# Altium schematic sheet 07_GSM_EM05.SchDoc: =TitleParameter
size A3; Address: Crete IL; Organization: ASISGUARD; Address1: Kemalpasa, Kemalpasa Cd. No:290 D:292H, 35060 Bornova/Izmir/Turkey
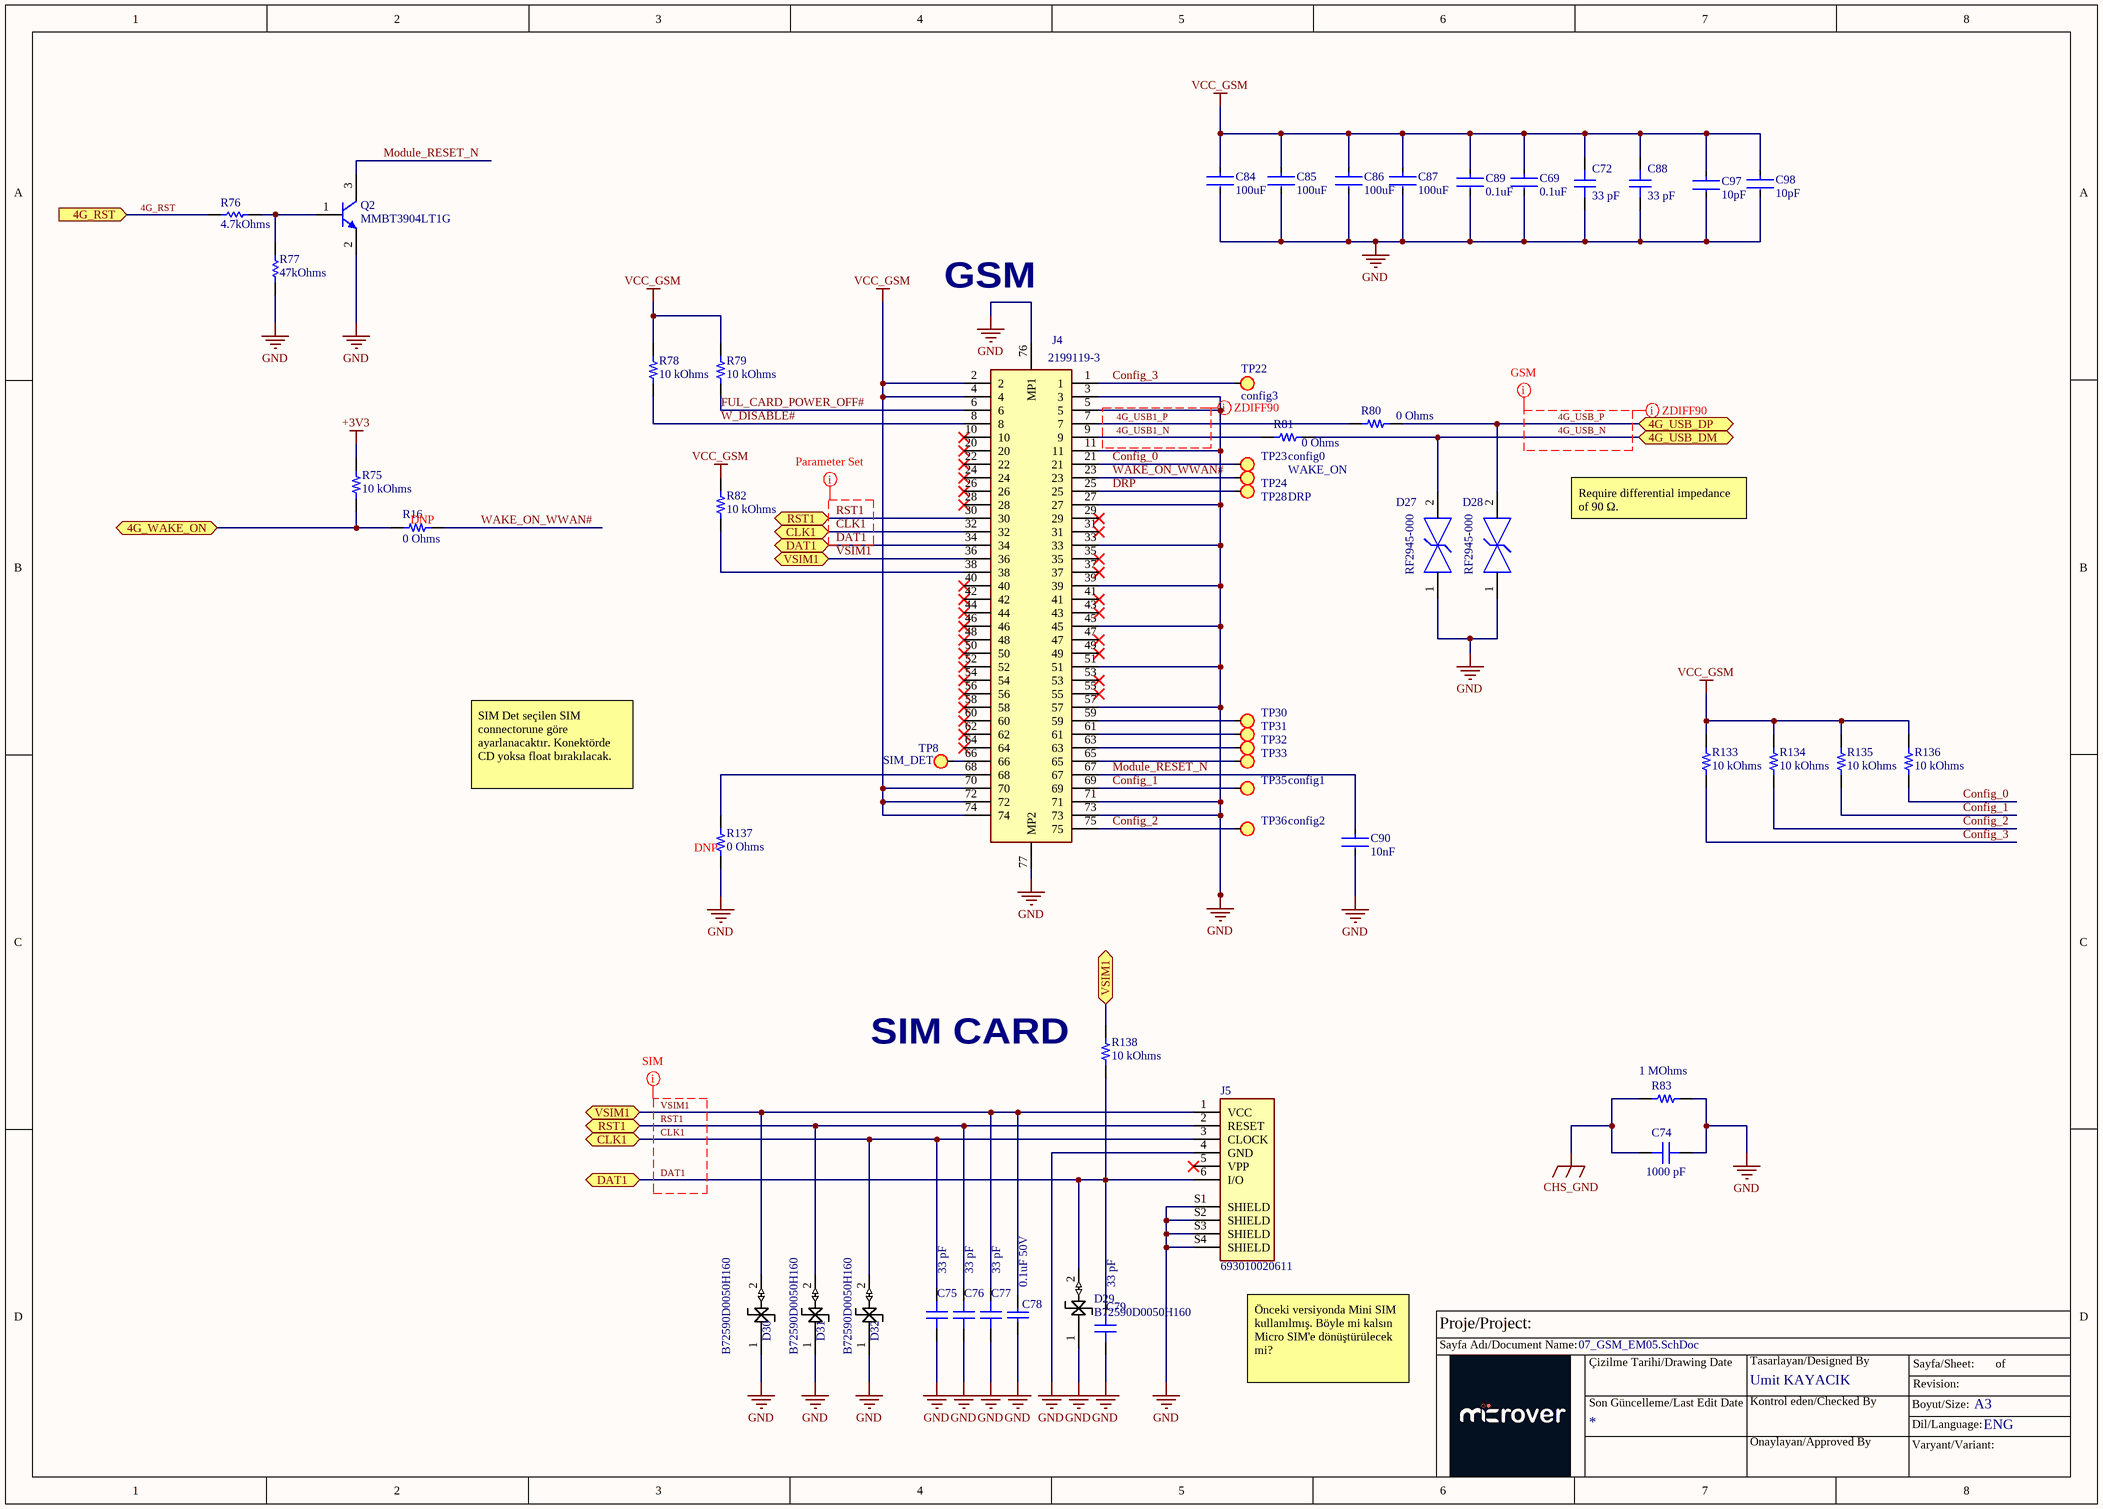
[diagram p0: 07_GSM_EM05.SchDoc]

## Parts
C69  0.1uF  [FP-GRM15-MFG]
C72  33 pF  [CAP0402(1005)X0.5]
C74  1000 pF  [CAP 1206_3216 - 0.8MM]
C75  33 pF  [CAP 0402_1005]
C76  33 pF  [CAP 0402_1005]
C77  33 pF  [CAP 0402_1005]
C78  value 0.1uF 50V  [SMC0603]  (hidden comment: CAP CER 0.1UF 50V X7R 0603)
C79  33 pF  [CAP 0402_1005]
C84  100uF  [FP-C3216-160-0_3-IPC_C]
C85  100uF  [FP-C3216-160-0_3-IPC_C]
C86  100uF  [FP-C3216-160-0_3-IPC_C]
C87  100uF  [FP-C3216-160-0_3-IPC_C]
C88  33 pF  [CAP0402(1005)X0.5]
C89  0.1uF  [FP-GRM15-MFG]
C90  10nF  [FP-CL165-IPC_C]
C97  10pF  [FP-CGA2B-MFG]
C98  10pF  [FP-CGA2B-MFG]
D27  RF2945-000  [FP-SESD0402-MFG]
D28  RF2945-000  [FP-SESD0402-MFG]
D29  B72590D0050H160  [SOD1005X60N]
D30  B72590D0050H160  [SOD1005X60N]
D31  B72590D0050H160  [SOD1005X60N]
D32  B72590D0050H160  [SOD1005X60N]
J4  2199119-3  [2199119-3]
J5  693010020611  [WURTH_693010020611]
Q2  MMBT3904LT1G  [ONSC-SOT-23-3-318-08_V]
R16  0 Ohms  [RES0402(1005)]
R75  10 kOhms  [RES 0402_1005]
R76  4.7kOhms  [RESC1005X40X25NL05T10]
R77  47kOhms  [RESC1005X40X25ML05T10]
R78  10 kOhms  [RES 0402_1005]
R79  10 kOhms  [RES 0402_1005]
R80  0 Ohms  [RES 0402_1005]
R81  0 Ohms  [RES 0402_1005]
R82  10 kOhms  [RES 0402_1005]
R83  1 MOhms  [RES 0402_1005]
R133  10 kOhms  [RES0402(1005)]
R134  10 kOhms  [RES0402(1005)]
R135  10 kOhms  [RES0402(1005)]
R136  10 kOhms  [RES0402(1005)]
R137  0 Ohms  [RES0402(1005)]
R138  10 kOhms  [RES0402(1005)]
TP8  SIM_DET  [TEST_POINT]
TP22  config3  [TEST_POINT]
TP23  config0  [TEST_POINT]
TP24  WAKE_ON  [TEST_POINT]
TP28  DRP  [TEST_POINT]
TP30  (no value)  [TEST_POINT]
TP31  config0  [TEST_POINT]  (value not drawn)
TP32  (no value)  [TEST_POINT]
TP33  (no value)  [TEST_POINT]
TP35  config1  [TEST_POINT]
TP36  config2  [TEST_POINT]

## Ports
4G_RST (in), 4G_USB_DM (bidir), 4G_USB_DP (bidir), 4G_WAKE_ON (bidir), CLK1 (bidir), DAT1 (bidir), RST1 (bidir), VSIM1 (bidir)

## Nets
+3V3: R75.2
CHS_GND: C74.1 R83.1
GND: C69.1 C72.1 C74.2 C75.1 C76.1 C77.1 C78.1 C79.1 C84.2 C85.2 C86.2 C87.2 C88.1 C89.1 C90.2 C97.2 C98.2 D27.1 D28.1 D29.1(GND) D30.1(GND) D31.1(GND) D32.1(GND) J4.3 J4.5 J4.11 J4.27 J4.33 J4.39 J4.45 J4.51 J4.57 J4.71 J4.73 J4.76(MP1) J4.77(MP2) J5.4(GND) J5.S1(SHIELD) J5.S2(SHIELD) J5.S3(SHIELD) J5.S4(SHIELD) Q2.2(E) R77.1 R83.2 R137.2
VCC_GSM: C69.2 C72.2 C84.1 C85.1 C86.1 C87.1 C88.2 C89.2 C97.1 C98.1 J4.2 J4.4 J4.70 J4.72 J4.74 R78.2 R79.2 R82.2 R133.2 R134.2 R135.2 R136.2
4G_RST: R76.1 ; port 4G_RST
4G_USB1_N: J4.9 R81.2
4G_USB1_P: J4.7 R80.2
4G_USB_N: D27.2 R81.1 ; port 4G_USB_DM
4G_USB_P: D28.2 R80.1 ; port 4G_USB_DP
4G_WAKE_ON: R16.1 R75.1 ; port 4G_WAKE_ON
CLK1: C75.2 D32.2(I/OLINE) J4.32 J5.3(CLOCK) ; port CLK1
Config_0: J4.21 R136.1 TP23.1(TP)
Config_1: J4.69 R135.1 TP35.1(TP)
Config_2: J4.75 R134.1 TP36.1(TP)
Config_3: J4.1 R133.1 TP22.1(TP)
DAT1: C79.2 D29.2(I/OLINE) J4.34 J5.6(I/O) R138.1 ; port DAT1
DRP: J4.25 TP28.1(TP)
FUL_CARD_POWER_OFF#: J4.6 R79.1
Module_RESET_N: C90.1 J4.67 Q2.3(C)
RST1: C76.2 D31.2(I/OLINE) J4.30 J5.2(RESET) ; port RST1
VSIM1: C77.2 C78.2 D30.2(I/OLINE) J4.36 J5.1(VCC) R138.2 ; port VSIM1
W_DISABLE#: J4.8 R78.1
WAKE_ON_WWAN#: J4.23 R16.2 TP24.1(TP)
NetJ4_38: J4.38 R82.1
NetJ4_59: J4.59 TP30.1(TP)
NetJ4_61: J4.61 TP31.1(TP)
NetJ4_63: J4.63 TP32.1(TP)
NetJ4_65: J4.65 TP33.1(TP)
NetJ4_66: J4.66 TP8.1(TP)
NetJ4_68: J4.68 R137.1
NetQ2_1: Q2.1(B) R76.2 R77.2

Not connected (* = marked no-connect by the designer): J4 10* 20* 22* 24* 26* 28* 29* 31* 35* 37* 40* 41* 42* 43* 44* 46* 47* 48* 49* 50* 52* 53* 54* 55* 56* 58* 60* 62* 64*; J5 5(VPP)*

## Layout directives
net class SIM: CLK1, DAT1, RST1, VSIM1
differential pair; differential pair class ZDIFF90: 4G_USB1_N, 4G_USB1_P, 4G_USB_N, 4G_USB_P
net class GSM: 4G_USB_N, 4G_USB_P
net class SIM; rule Matched Net Lengths [Tolerance = 20mil]: CLK1, DAT1, RST1

## Notes on the sheet
- GSM
- Require differential impedance of 90 Ω.
- (near R16) DNP
- SIM Det seçilen SIM connectorune göre ayarlanacaktır. Konektörde CD yoksa float bırakılacak.
- (near R137) DNP
- SIM CARD
- Önceki versiyonda Mini SIM kullanılmış. Böyle mi kalsın Micro SIM'e dönüştürülecek mi?
- Proje/Project:
- Sayfa Adı/Document Name:
- Çizilme Tarihi/Drawing Date
- Umit KAYACIK
- Tasarlayan/Designed By
- Sayfa/Sheet:
- Revision:
- of
- Son Güncelleme/Last Edit Date
- Kontrol eden/Checked By
- Onaylayan/Approved By
- Boyut/Size:
- Varyant/Variant:
- Dil/Language:
- A3
- ENG

## Library data of the parts
C69 C89 = CMP-2100-03641-2: CAP CER 0.1UF 16V X7R 0402; Part Number: GRM155R71C104KA88D; Manufacturer: Murata; Standoff Height: 0mm; Tolerance: 10%; Voltage Rating: 16Vdc; Material: Ceramic; Capacitance: 0.10μF; Value: 0.10μF; RoHS: TRUE; Temperature Characteristic: X7R; Octopart: https://octopart.com/grm155r71c104ka88d-murata-196880; Digikey Description: CAP CER 0.1UF 16V X7R 0402; Device Class L3: Ceramic Capacitors; Height: 0.55mm; ComponentLink2Description: Datasheet; Temperature Range Low: -55°C; Ipc Land Pattern Name: CAPC10050X219; ComponentLink2URL: https://search.murata.co.jp/Ceramy/image/img/A01X/G101/ENG/GRM155R71H471KA01-01A.pdf; Device Class L1: Passive Components; Lead Free: yes; Category: Cap; Package: GRM15; Temperature: -55°C to +125°C; Device Class L2: Capacitors; Temperature Range High: +125°C; Mouser Description: 0402 0.1 uF 16V ±10 % Tolerance X7R SMT Multilayer Ceramic Capacitor
C72 C75-C77 C79 C88 = 885012005043: CAP CER 33PF 25V C0G/NP0 0402; manufacturer: Würth Elektronik; Temperature Coefficient: C0G, NP0; Tolerance: ±5%; Part Number: 885012005043; Value: 33 pF; Applications: General Purpose; Capacitance: 33 pF; componentlink1description: Datasheet; componentlink1url: https://katalog.we-online.de/pbs/datasheet/885012005043.pdf; componentlink2description: DigiKey Link; componentlink2url: https://www.digikey.com/en/products/detail/würth-elektronik/885012005043/5453313; Device Package: 0402 (1005 Metric); lastupdated: 2/9/2024 8:04:37 PM; Lifecycle Status: Active; Minimum Order: 1; Mounting Type: Surface Mount, MLCC; Operating Temperature: -55°C ~ 125°C; Package / Case: 0402 (1005 Metric); packaging: TapeAndReel; partid: 2058; Part Status: Active; price: 0.01; series: WCAP-CSGP; Size / Dimension: 0.039" L x 0.020" W (1.00mm x 0.50mm); Supplier 1: DigiKey; Supplier Part Number 1: 732-7458-1-ND; Thickness (Max): 0.022" (0.55mm); Voltage - Rated: 25V
C74 = 202R18W102KV4E: CAP CER 1000PF 2KV X7R 1206; Part Number: 202R18W102KV4E; Value: 1000 pF
C78 = CAP0603_0.1UF_50V: 0.1 µF ±10% 50V Ceramic Capacitor X7R 0603 (1608 Metric); Manufacturer Part Number: CL10B104KB8NNNL; LCSC Manufacturer Part Number: CL10B104KB8NNNC; Order Code: DIGI:1276-CL10B104KB8NNNLTR-ND; Sirius Stock Code: A063-AGC10300001226; LCSC Part Number: C1591
C84-C87 = CMP-2000-05396-3: Multilayer Ceramic Capacitors 100uF ±20% 10V X5R SMD 1206; Part Number: C3216X5R1A107M160AC; Voltage Rating (DC): 10V; Length: 3.2mm; Mount: Surface Mount; Depth: 1.6mm; Width: 1.6mm; Package Quantity: 1; Min Operating Temperature: -55°C; Packaging: Tape and Reel; Max Operating Temperature: 85°C; Dielectric: X5R; Construction: Flat; Case Code (Imperial): 1206; Capacitance: 100uF; Thickness: 0.075inch; Radiation Hardening: No; RoHS Compliant: Yes; Series: C; Dielectric Material: Ceramic; Voltage: 10V; REACH SVHC: No SVHC; Case Code (Metric): 3216; Weight: 0.000571oz; Height: 1.6mm; Voltage Rating: 10V; Termination: SMD/SMT; Lead Free: Lead Free; Tolerance: 20%; Case/Package: 1206; Resistor Type: Ceramic
C90 = CMP-13271-000387-1: Cap Ceramic 10nF 50V X7R ±10% SMD 0402 +125°C Paper T/R; Part Number: CL05B103KB5NNNC; Depth: 0.5mm; Length: 1mm; Lead Free: Lead Free; Case Code (Metric): 1005; Width: 0.02inch; Min Operating Temperature: -55°C; Thickness: 0.022inch; Package Quantity: 1; Mount: Surface Mount; Height: 0.5mm; Voltage: 50V; Material: Ceramic; Tolerance: 10%; Case Code (Imperial): 0402; Radiation Hardening: No; Case/Package: 0402; Max Operating Temperature: 125°C; Voltage Rating (DC): 50V; Contact Plating: Tin; Packaging: Tape and Reel; Voltage Rating: 50V; Capacitance: 10nF; Dielectric: X7R
C97 C98 = CMP-08246-001268-1: Cap Ceramic 10pF 50V C0G 0.5pF Pad SMD 0402 +125°C Automotive T/R; Part Number: CGA2B2C0G1H100D050BA; Max Operating Temperature: 125°C; Termination: SMD/SMT; Composition: Ceramic; Case Code (Metric): 1005; Length: 1mm; Depth: 0.5mm; Height: 0.5mm; Voltage Rating (DC): 50V; Case Code (Imperial): 0402; Packaging: Tape and Reel; Weight: 2.3E-05oz; Thickness: 0.022inch; Case/Package: 0402; Package Quantity: 1; Min Operating Temperature: -55°C; REACH SVHC: No SVHC; Lead Free: Lead Free; Dielectric: C0G; Width: 0.5mm; Voltage Rating: 50V; Mount: Surface Mount; Capacitance: 10pF; Ratings: AEC-Q200
D27 D28 = CMP-08607-000062-1: TVS DIODE 7V 10V 0402; Manufacturer: Littelfuse; Value: 0.1pF; Breakdown Voltage: 9.8V; Number Of Channels: 1; Peak Pulse Current: 2A; Direction: Bidirectional; Automotive Grade: Grade 1; Standoff Height: 0mm; Octopart: https://octopart.com/rf2945-000-littelfuse-56516902; Device Class L3: unset; ComponentLink2Description: Datasheet; Lead Free: Yes; Temperature Range Low: -55°C; Clamping Voltage: 10V; Digikey Description: TVS DIODE 7V 10V 0402; Category: Diode; Temperature: -55°C to +125°C; Device Class L1: Circuit Protection; Capacitance: 0.1pF; RoHS: TRUE; Device Class L2: TVS Diodes; Package: SESD0402; Reverse Standoff Voltage: 7V; Automotive: Yes; Height: 0.43mm; Manufacturer Part Number: RF2945-000; Temperature Range High: +125°C; ComponentLink2URL: https://www.littelfuse.com/~/media/electronics/datasheets/tvs_diode_arrays/littelfuse_tvs_diode_array_sesd_ultra_low_capacitance_discrete_tvs_datasheet.pdf.pdf
D29-D32 = B72590D0050H160: VARISTOR 150V 0402; Manufacturer: TDK EPCOS; Supplier 1: Digikey; Manufacturer Part Number: B72590D0050H160; RoHS: Yes; Category: Varistors; Stock 1: 130000; Pricing 1: 10000=0,04977, 30000=0,04666, 50000=0,04137, 100000=0,04044, 250000=0,03982 (USD); ComponentLink1URL: https://datasheet.octopart.com/B72590D0050H160-EPCOS-datasheet-10468447.pdf?src-supplier=Newark; ComponentLink1Description: https://datasheet.octopart.com/B72590D0050H160-EPCOS-datasheet-10468447.pdf?src-supplier=Newark; ComponentLink2URL: https://en.tdk.eu/inf/75/ds/High_speed_series.pdf?src-supplier=Verical; ComponentLink2Description: https://en.tdk.eu/inf/75/ds/High_speed_series.pdf?src-supplier=Verical; ComponentLink3URL: http://www.farnell.com/datasheets/1706828.pdf?src-supplier=Newark; ComponentLink3Description: http://www.farnell.com/datasheets/1706828.pdf?src-supplier=Newark; ComponentLink4URL: https://en.tdk.eu/inf/75/ds/High_speed_series.pdf?src-supplier=Digikey; ComponentLink4Description: https://en.tdk.eu/inf/75/ds/High_speed_series.pdf?src-supplier=Digikey; ComponentLink5URL: https://www.tdk-electronics.tdk.com/inf/75/ds/High_speed_series.pdf?src-supplier=Digikey; ComponentLink5Description: https://www.tdk-electronics.tdk.com/inf/75/ds/High_speed_series.pdf?src-supplier=Digikey; ComponentLink6URL: https://en.tdk.eu/inf/75/ds/High_speed_series.pdf?src-supplier=Arrow+Electronics; ComponentLink6Description: https://en.tdk.eu/inf/75/ds/High_speed_series.pdf?src-supplier=Arrow+Electronics; ComponentLink7URL: https://en.tdk.eu/inf/75/ds/High_speed_series.pdf?src-supplier=Quest; ComponentLink7Description: https://en.tdk.eu/inf/75/ds/High_speed_series.pdf?src-supplier=Quest; ComponentLink8URL: https://datasheet.octopart.com/B72590D0050H160-EPCOS-datasheet-157245974.pdf?src-supplier=LKR; ComponentLink8Description: https://datasheet.octopart.com/B72590D0050H160-EPCOS-datasheet-157245974.pdf?src-supplier=LKR; ComponentLink9URL: https://en.tdk.eu/inf/75/ds/High_speed_series.pdf?src-supplier=TTI; ComponentLink9Description: https://en.tdk.eu/inf/75/ds/High_speed_series.pdf?src-supplier=TTI; Supplier Part Number 1: 495-3684-2-ND
J4 = 2199119-3: Conn Power Card Edge Socket 67 POS 0.5mm Solder RA SMD T/R; Manufacturer: TE Connectivity; Plating: 157ConductorMaterial; Number of Positions: 67; PCB Mounting Orientation: Right Angle; Contact Current Rating: 500mA; Gender: Female; Voltage Rating: 50V; Insulation Resistance: 500MR; Circuit Application: 313ConnectorType; Row Spacing: 7.55mm; Supplier: Avnet; Part Number: 2199119-3; Manufacturer Part Number: 2199119-3; RoHS: Yes; Category: Card Edge Connectors; Stock: 40583; Pricing: 1200=0.83929, 2400=0.83264, 4800=0.8263, 7200=0.81996, 9600=0.81362 (USD); Mounting Technology: Surface Mount; Contact Material: Copper Alloy; Contact Plating: Gold,Matte; Housing Color: Black; Housing Material: Thermoplastic; Color: Black; Insulation Material: Thermoplastic; Min Operating Temperature: -40°C; Max Operating Temperature: 80°C; Packaging: Tape and Reel; Number of Rows: 2; Package Quantity: 1200; Current Rating: 500mA; Termination: Solder; Number of Contacts: 67; Series: -; Contact Type: -; Operating Supply Voltage: 50V; Length: 0.862inch; Width: 8.7mm; Height: 3.2mm; Pitch: 0.5mm; Radiation Hardening: No; RoHS Compliant: Yes; Reach SVHC Compliant: Unknown; ELV: 5681ELVCompliant; ComponentLink1URL: https://datasheet.ciiva.com/18495/eng-cd-2199119-c-c-2199119-c-18495968.pdf?src-supplier=Digikey; ComponentLink1Description: https://datasheet.ciiva.com/18495/eng-cd-2199119-c-c-2199119-c-18495968.pdf?src-supplier=Digikey; ComponentLink2URL: https://datasheet.ciiva.com/32373/eng-ds-1-1773702-1ngffqrg-en-0513-1-1773702-1-ngff-qrg-en-32373486.pdf?src-supplier=Onlinecomponents.com; ComponentLink2Description: https://datasheet.ciiva.com/32373/eng-ds-1-1773702-1ngffqrg-en-0513-1-1773702-1-ngff-qrg-en-32373486.pdf?src-supplier=Onlinecomponents.com; ComponentLink3URL: https://datasheet.ciiva.com/18495/eng-cd-2199119-c-c-2199119-c-18495966.pdf?src-supplier=Digikey; ComponentLink3Description: https://datasheet.ciiva.com/18495/eng-cd-2199119-c-c-2199119-c-18495966.pdf?src-supplier=Digikey; ComponentLink4URL: https://datasheet.ciiva.com/18495/eng-cd-2199119-c-c-2199119-c-18495967.pdf?src-supplier=Digikey; ComponentLink4Description: https://datasheet.ciiva.com/18495/eng-cd-2199119-c-c-2199119-c-18495967.pdf?src-supplier=Digikey; ComponentLink5URL: https://datasheet.ciiva.com/45228/eng-cd-2199119-b1-45228583.pdf?src-supplier=Avnet; ComponentLink5Description: https://datasheet.ciiva.com/45228/eng-cd-2199119-b1-45228583.pdf?src-supplier=Avnet; ComponentLink6URL: https://datasheet.ciiva.com/24089/eng-ds-1-1773702-1ngffqrg-en-0513-1-1773702-1-ngff-252877-24089929.pdf?src-supplier=Mouser; ComponentLink6Description: https://datasheet.ciiva.com/24089/eng-ds-1-1773702-1ngffqrg-en-0513-1-1773702-1-ngff-252877-24089929.pdf?src-supplier=Mouser
J5 = 693010020611: WR-CRD Mini SIM Card Connector Header Shielded; Manufacturer: Wurth Electronics; Supplier 1: Digikey; Manufacturer Part Number: 693010020611; RoHS: Yes; Category: Memory Connectors; Stock 1: 1000; Pricing 1: 1000=1.04 (USD); ComponentLink1URL: https://datasheet.ciiva.com/25605/0900766b81113f2a-25605361.pdf?src-supplier=Rs; ComponentLink1Description: https://datasheet.ciiva.com/25605/0900766b81113f2a-25605361.pdf?src-supplier=Rs; ComponentLink2URL: https://datasheet.ciiva.com/1104/693010020611-1104791.pdf?src-supplier=Element14; ComponentLink2Description: https://datasheet.ciiva.com/1104/693010020611-1104791.pdf?src-supplier=Element14; ComponentLink3URL: https://datasheet.ciiva.com/6934/693010020611-6934683.pdf?src-supplier=Digikey; ComponentLink3Description: https://datasheet.ciiva.com/6934/693010020611-6934683.pdf?src-supplier=Digikey; ComponentLink4URL: https://datasheet.ciiva.com/6934/693010020611-6934685.pdf?src-supplier=Digikey; ComponentLink4Description: https://datasheet.ciiva.com/6934/693010020611-6934685.pdf?src-supplier=Digikey; ComponentLink5URL: https://datasheet.ciiva.com/6934/693010020611-6934687.pdf?src-supplier=Digikey; ComponentLink5Description: https://datasheet.ciiva.com/6934/693010020611-6934687.pdf?src-supplier=Digikey; ComponentLink6URL: https://datasheet.ciiva.com/48686/001088834-da-01-en-wr-crd-sim-kartensockel-693010020611-48686971.pdf?src-supplier=Conrad; ComponentLink6Description: https://datasheet.ciiva.com/48686/001088834-da-01-en-wr-crd-sim-kartensockel-693010020611-48686971.pdf?src-supplier=Conrad; Supplier Part Number 1: 732-3814-2-ND
Q2 = CMP-1048-00631-1: General Purpose Transistor, NPN Silicon, 3-Pin SOT-23, Pb-Free, Tape and Reel; Manufacturer: On Semiconductor; IC Continuous (A): 0.2; fT Min (MHz): 300; ComponentLink2Description: Datasheet; Polarity: NPN; PackageDescription: 3-Pin Small Outline Transistor, Body 2.92 x 1.3 mm, Pitch 0.95 mm; ComponentLink2URL: http://www.onsemi.cn/pub_link/Collateral/MMBT3904LT1-D.PDF; DatasheetVersion: Rev. 12; Mounting Technology: Surface Mount; PartNumber: MMBT3904LT1G; ComponentLink1URL: http://www.onsemi.com/; ComponentLink3Description: Package Specification; ComponentLink1Description: Manufacturer URL; PackageVersion: Rev. AP, 11/2009; PackageReference: SOT-23-3-318-08; Packing: Tape and Reel; ComponentLink3URL: http://www.onsemi.cn/pub_link/Collateral/318-08.PDF; RoHS: TRUE
R16 R80 R81 R137 = HCJ0402ZT0R00: RES 0 OHM JUMPER 1/8W 0402; Manufacturer: Stackpole Electronics Inc; Power (Watts): 0.125W, 1/8W; Part Number: HCJ0402ZT0R00; Value: 0 Ohms; ComponentLink1Description: Datasheet; ComponentLink1URL: https://www.seielect.com/catalog/sei-hcj.pdf; ComponentLink2Description: DigiKey Link; ComponentLink2URL: https://www.digikey.com/en/products/detail/stackpole-electronics-inc/HCJ0402ZT0R00/4357659; Composition: Metal Foil; Device Package: 0402 (1005 Metric); Features: Automotive AEC-Q200; Height - Seated (Max): 0.018" (0.45mm); LastUpdated: 2/9/2024 8:29:49 PM; Lifecycle Status: Active; Minimum Order: 1; Number of Terminations: 2; Operating Temperature: -55°C ~ 155°C; Package / Case: 0402 (1005 Metric); Packaging: TapeAndReel; PartId: 12327; Part Status: Active; Price: 0.07; Ratings: AEC-Q200; Resistance: 0 Ohms; Series: HCJ; Size / Dimension: 0.039" L x 0.020" W (1.00mm x 0.50mm); Supplier 1: DigiKey; Supplier Part Number 1: HCJ0402ZT0R00CT-ND; Supplier Device Package: 0402; Tolerance: Jumper
R75 R78 R79 R82 R133-R136 R138 = RP73PF1E10KBTD: RES 10K OHM 0.1% 1/10W 0402; Manufacturer: TE Connectivity Passive Product; Power (Watts): 0.1W, 1/10W; Temperature Coefficient: ±25ppm/°C; Part Number: RP73PF1E10KBTD; Value: 10 kOhms; ComponentLink1Description: Datasheet; ComponentLink1URL: https://www.te.com/commerce/DocumentDelivery/DDEController?Action=srchrtrv&DocNm=1773272&DocType=DS&DocLang=English; ComponentLink2Description: DigiKey Link; ComponentLink2URL: https://www.digikey.com/en/products/detail/te-connectivity-passive-product/RP73PF1E10KBTD/8260957; Composition: Thin Film; Device Package: 0402 (1005 Metric); Height - Seated (Max): 0.014" (0.35mm); LastUpdated: 2/9/2024 8:30:24 PM; Lifecycle Status: Active; Minimum Order: 1; Number of Terminations: 2; Operating Temperature: -55°C ~ 155°C; Package / Case: 0402 (1005 Metric); Packaging: TapeAndReel; PartId: 2434; Part Status: Active; Price: 0.08; Resistance: 10 kOhms; Series: RP73, Holsworthy; Size / Dimension: 0.039" L x 0.020" W (1.00mm x 0.50mm); Supplier 1: DigiKey; Supplier Part Number 1: A127415CT-ND; Supplier Device Package: 0402; Tolerance: ±0.1%
R76 = CMP-1011-00586-2: Manufacturer: Yageo / Phycomp; Part Number: RC0402FR-074K7L
R77 = CMP-2002-03053-1: Part Number: CRCW040247K0FKEDHP; Manufacturer: Vishay Dale
R83 = ESR01MZPF1004: ANTI-SURGE CHIP RESISTORS; Part Number: ESR01MZPF1004; Value: 1 MOhms
TP8 TP22-TP24 TP28 TP30-TP33 TP35 TP36 = TP_1